# Altium schematic sheet TK104_Pulsbegrenser_Eurorack_faderboard.SchDoc
size A3; Revision: 6
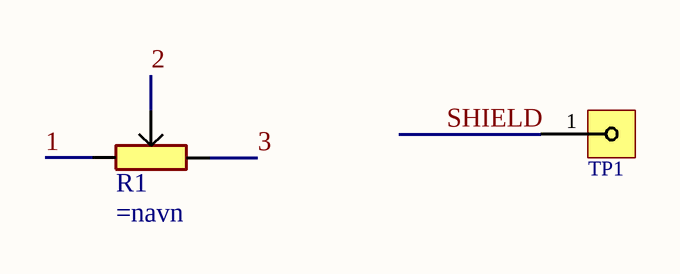
[diagram p0: TK104_Pulsbegrenser_Eurorack_faderboard.SchDoc]

## Parts
R1  (no value)  [PTA4543-2015DPB103]
TP1  Header1x1  [HDRV1W64P254_1X1_254X254X900B]  (value not drawn)

## Nets
1: R1.1
2: R1.2
3: R1.3
SHIELD: TP1.1

## Notes on the sheet
- Size:
- Date:
- Title:
- A3
- Revision:
- Sheet
- of
- Author:
- File:

## Library data of the parts
R1 = Potmeter
TP1 = 2428: id: 2428; pakke_opprettet_av: 815; beskrivelse: 2,54mm pitch; pris: 1; pakketype: TH; pakke_opprettet: 13.11.2014 12:30:32; symbol_opprettet_av: 815; symbol_opprettet: 13.11.2014 10:58:46; navn: Header 1x1